# Altium schematic sheet arduinoshield.SchDoc
size A4; Organization: Altium Limited; Address1: L3, 12a Rodborough Rd; Address2: Frenchs Forest; Address3: NSW; Address4: Australia 2086
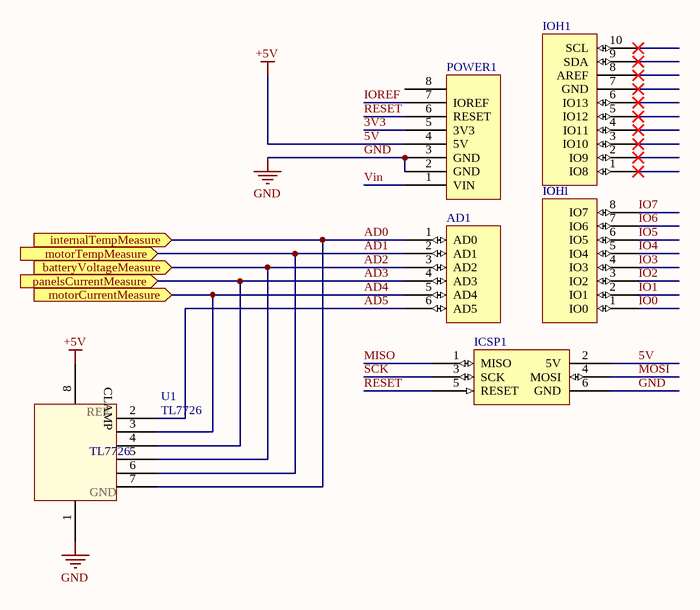
[diagram p0: arduinoshield.SchDoc]

## Parts
AD1  AD  [Header 6x1 8.5mm]  (value not drawn)
ICSP1  ICSP  [ICSP]  (value not drawn)  (mechanical)
IOH1  IOH  [Header 10x1 8.5mm]
IOL1  IOL  [Header 8x1 8.5mm]  (value not drawn)
POWER1  POWER_UNO  [Header 8x1 8.5mm]  (value not drawn)
U1  TL7726  [DIP8-300]

## Ports
batteryVoltageMeasure (in), internalTempMeasure (in), motorCurrentMeasure (in), motorTempMeasure (in), panelsCurrentMeasure (in)

## Nets
5V: ICSP1.2(5V) POWER1.4(5V) U1.8(REF)  [also labelled +5V]
GND: ICSP1.6(GND) POWER1.2(GND) POWER1.3(GND) U1.1(GND)
3V3: POWER1.5(3V3)
AD0: AD1.1(AD0) U1.7(CLAMP) ; port internalTempMeasure
AD1: AD1.2(AD1) U1.6(CLAMP) ; port motorTempMeasure
AD2: AD1.3(AD2) U1.5(CLAMP) ; port batteryVoltageMeasure
AD3: AD1.4(AD3) U1.4(CLAMP) ; port panelsCurrentMeasure
AD4: AD1.5(AD4) U1.3(CLAMP) ; port motorCurrentMeasure
AD5: AD1.6(AD5) U1.2(CLAMP)
IO0: IOL1.1(IO0)
IO1: IOL1.2(IO1)
IO2: IOL1.3(IO2)
IO3: IOL1.4(IO3)
IO4: IOL1.5(IO4)
IO5: IOL1.6(IO5)
IO6: IOL1.7(IO6)
IO7: IOL1.8(IO7)
IOREF: POWER1.7(IOREF)
MISO: ICSP1.1(MISO)
MOSI: ICSP1.4(MOSI)
RESET: ICSP1.5(RESET) POWER1.6(RESET)
SCK: ICSP1.3(SCK)
Vin: POWER1.1(VIN)

Not connected (* = marked no-connect by the designer): IOH1 1(IO8)* 2(IO9)* 3(IO10)* 4(IO11)* 5(IO12)* 6(IO13)* 7(GND)* 8(AREF)* 9(SDA)* 10(SCL)*; POWER1 8

## Notes on the sheet
- Title
- Size:
- Date:
- A4
- Number:
- Time:
- Revision:
- Sheet
- of
- File:

## Library data of the parts
U1 = TL7726: Hex Clamping Circuit - Overvoltage Limiter